# Altium schematic sheet Top Level.SchDoc
size 431 x 279 mm; CompanyName: Penn Electric Racing; Organization: Penn Electric Racing; Address1: 220 S. 33rd St; Address2: Towne Bldg, B11; Address3: Philadelpia, PA 19104; Address4: USA; SheetNumber: 1; SheetTotal: 12
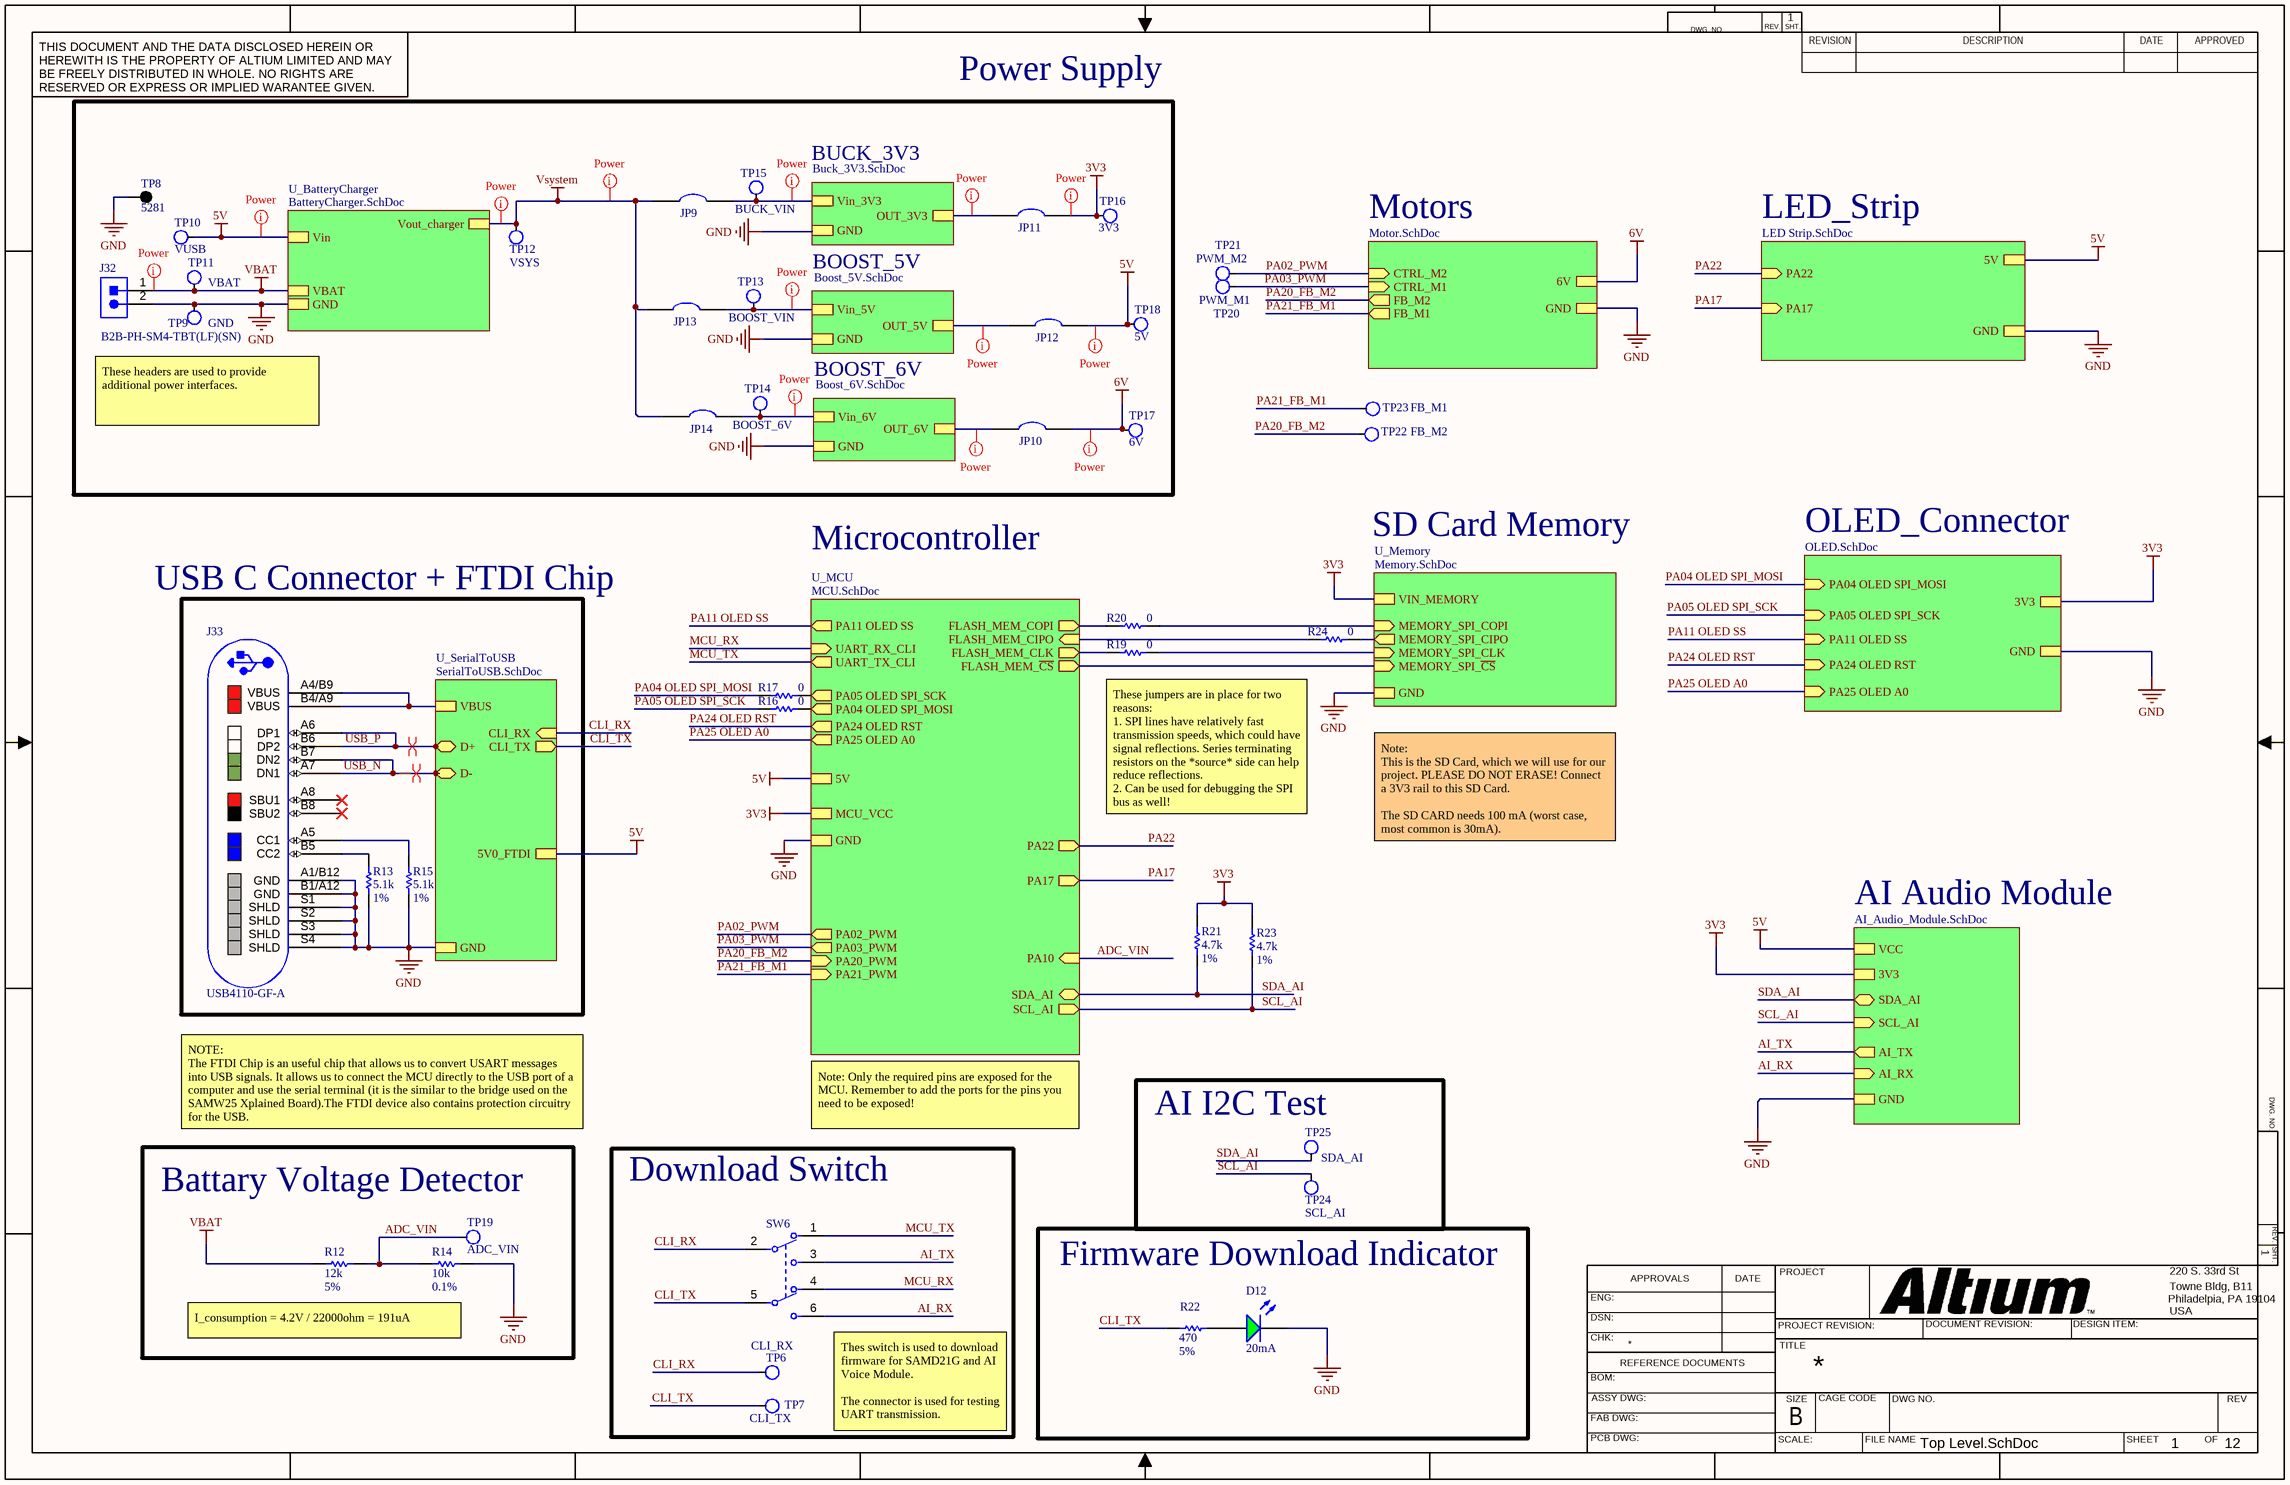
[diagram p0: Top Level.SchDoc]

## Parts
D12  Current: 20mA  [LED_0805]  (hidden comment: LSM0805452V)
J32  B2B-PH-SM4-TBT(LF)(SN)  [FP-B2B-PH-SM4-TBT_LF_SN-MFG]
J33  USB4110-GF-A  [FP-USB4110-GF-A-MFG]
JP9  0603 link  [0603_JP_RES]  (value not drawn)
JP10  0603 link  [0603_JP_RES]  (value not drawn)
JP11  0603 link  [0603_JP_RES]  (value not drawn)
JP12  0603 link  [0603_JP_RES]  (value not drawn)
JP13  0603 link  [0603_JP_RES]  (value not drawn)
JP14  0603 link  [0603_JP_RES]  (value not drawn)
R12  value 12k  Tolerance: 5%  [0603_RES]  (hidden comment: RES 0603 12K 5%)
R13  value 5.1k  Tolerance: 1%  [0603_RES]  (hidden comment: RES 0603 5.1K 1%)
R14  value 10k  Tolerance: 0.1%  [0603_RES]  (hidden comment: RES 0603 10K 0.1%)
R15  value 5.1k  Tolerance: 1%  [0603_RES]  (hidden comment: RES 0603 5.1K 1%)
R16  value 0  [0603_RES]  (hidden comment: RES 0603 0 5%)
R17  value 0  [0603_RES]  (hidden comment: RES 0603 0 5%)
R19  value 0  [0603_RES]  (hidden comment: RES 0603 0 5%)
R20  value 0  [0603_RES]  (hidden comment: RES 0603 0 5%)
R21  value 4.7k  Tolerance: 1%  [0603_RES]  (hidden comment: RES 0603 4.7K 1%)
R22  value 470  Tolerance: 5%  [0805_RES]  (hidden comment: RES 0805 470 5%)
R23  value 4.7k  Tolerance: 1%  [0603_RES]  (hidden comment: RES 0603 4.7K 1%)
R24  value 0  [0603_RES]  (hidden comment: RES 0603 0 5%)
SW6  JS202011JCQN  [FP-JS202011JCQN-MFG]  (value not drawn)
TP6  NetName: CLI_RX  [Keystone 5000 Series]  (hidden comment: Testpad)  (no BOM)
TP7  NetName: CLI_TX  [Keystone 5000 Series]  (hidden comment: Testpad)  (no BOM)
TP8  5281  [KSTN-5011_V]
TP9  NetName: GND  [Testpad-HeaderPin]  (hidden comment: Testpad)  (no BOM)
TP10  NetName: VUSB  [Keystone 5000 Series]  (hidden comment: Testpad)  (no BOM)
TP11  NetName: VBAT  [Keystone 5000 Series]  (hidden comment: Testpad)  (no BOM)
TP12  NetName: VSYS  [Keystone 5000 Series]  (hidden comment: Testpad)  (no BOM)
TP13  NetName: BOOST_VIN  [Keystone 5000 Series]  (hidden comment: Testpad)  (no BOM)
TP14  NetName: BOOST_6V  [Keystone 5000 Series]  (hidden comment: Testpad)  (no BOM)
TP15  NetName: BUCK_VIN  [Keystone 5000 Series]  (hidden comment: Testpad)  (no BOM)
TP16  NetName: 3V3  [Keystone 5000 Series]  (hidden comment: Testpad)  (no BOM)
TP17  NetName: 6V  [Keystone 5000 Series]  (hidden comment: Testpad)  (no BOM)
TP18  NetName: 5V  [Keystone 5000 Series]  (hidden comment: Testpad)  (no BOM)
TP19  NetName: ADC_VIN  [Keystone 5000 Series]  (hidden comment: Testpad)  (no BOM)
TP20  NetName: PWM_M1  [Keystone 5000 Series]  (hidden comment: Testpad)  (no BOM)
TP21  NetName: PWM_M2  [Keystone 5000 Series]  (hidden comment: Testpad)  (no BOM)
TP22  NetName: FB_M2  [Keystone 5000 Series]  (hidden comment: Testpad)  (no BOM)
TP23  NetName: FB_M1  [Keystone 5000 Series]  (hidden comment: Testpad)  (no BOM)
TP24  NetName: SCL_AI  [Keystone 5000 Series]  (hidden comment: Testpad)  (no BOM)
TP25  NetName: SDA_AI  [Keystone 5000 Series]  (hidden comment: Testpad)  (no BOM)

## Blocks framed on the sheet
Power Supply: J32 JP9-JP14 TP8-TP18
AI I2C Test: TP24 TP25
Battary Voltage Detector: R12 R14 TP19
Download Switch: SW6 TP6 TP7
Firmware Download Indicator: D12 R22

## Sub-sheets
AI Audio Module = AI_Audio_Module.SchDoc: SDA_AI (bidir), 3V3, GND, SCL_AI (in), AI_TX (out), AI_RX (in), VCC
BOOST_5V = Boost_5V.SchDoc: Vin_5V, OUT_5V, GND
BOOST_6V = Boost_6V.SchDoc: Vin_6V, OUT_6V, GND
BUCK_3V3 = Buck_3V3.SchDoc: Vin_3V3, OUT_3V3, GND
LED_Strip = LED Strip.SchDoc: PA22 (in), 5V, GND, PA17 (in)
Motors = Motor.SchDoc: 6V, GND, CTRL_M2 (in), CTRL_M1 (in), FB_M2 (out), FB_M1 (out)
OLED_Connector = OLED.SchDoc: PA04 OLED SPI_MOSI (in), PA05 OLED SPI_SCK (in), 3V3, PA11 OLED SS (in), GND, PA24 OLED RST (in), PA25 OLED A0 (in)
U_BatteryCharger = BatteryCharger.SchDoc: Vin, GND, VBAT, Vout_charger
U_MCU = MCU.SchDoc: MCU_VCC, GND, FLASH_MEM_~{CS} (out), FLASH_MEM_CLK (out), FLASH_MEM_CIPO (in), FLASH_MEM_COPI (out), PA02_PWM (out), PA03_PWM (out), PA20_PWM (in), PA21_PWM (in), PA22 (out), PA17 (out), PA10 (in), SDA_AI (bidir), SCL_AI (out), UART_TX_CLI (out), UART_RX_CLI (in), PA11 OLED SS (out), PA04 OLED SPI_MOSI (out), PA05 OLED SPI_SCK (out), PA25 OLED A0 (out), PA24 OLED RST (out), 5V
U_Memory = Memory.SchDoc: MEMORY_SPI_COPI (in), MEMORY_SPI_CIPO (out), MEMORY_SPI_CLK (in), MEMORY_SPI_~{CS} (in), VIN_MEMORY, GND
U_SerialToUSB = SerialToUSB.SchDoc: CLI_RX (in), CLI_TX (out), 5V0_FTDI, D- (bidir), D+ (bidir), GND, VBUS

## Nets
3V3: JP11.2 R21.2 R23.2 TP16.1 ; sheet U_MCU/MCU_VCC, sheet U_Memory/VIN_MEMORY, sheet OLED_Connector/3V3, sheet AI Audio Module/3V3
5V: JP12.2 TP10.1 TP18.1 ; sheet U_BatteryCharger/Vin, sheet U_SerialToUSB/5V0_FTDI, sheet U_MCU/5V, sheet LED_Strip/5V, sheet AI Audio Module/VCC
6V: JP10.2 TP17.1 ; sheet Motors/6V
GND: D12.K J32.2 J33.A1/B12(GND) J33.B1/A12(GND) J33.S1(SHLD) J33.S2(SHLD) J33.S3(SHLD) J33.S4(SHLD) R13.1 R14.2 R15.1 TP8.1 TP9.1 ; sheet U_BatteryCharger/GND, sheet U_SerialToUSB/GND, sheet U_MCU/GND, sheet U_Memory/GND, sheet Motors/GND, sheet LED_Strip/GND, sheet OLED_Connector/GND, sheet AI Audio Module/GND, sheet BUCK_3V3/GND, sheet BOOST_5V/GND, sheet BOOST_6V/GND
VBAT: J32.1 R12.1 TP11.1 ; sheet U_BatteryCharger/VBAT
Vsystem: JP9.1 JP13.1 JP14.1 TP12.1 ; sheet U_BatteryCharger/Vout_charger
ADC_VIN: R12.2 R14.1 TP19.1 ; sheet U_MCU/PA10
AI_RX: SW6.6 ; sheet AI Audio Module/AI_RX
AI_TX: SW6.3 ; sheet AI Audio Module/AI_TX
CLI_RX: SW6.2 TP6.1 ; sheet U_SerialToUSB/CLI_RX
CLI_TX: R22.1 SW6.5 TP7.1 ; sheet U_SerialToUSB/CLI_TX
MCU_RX: SW6.4 ; sheet U_MCU/UART_RX_CLI
MCU_TX: SW6.1 ; sheet U_MCU/UART_TX_CLI
PA02_PWM: TP21.1 ; sheet U_MCU/PA02_PWM, sheet Motors/CTRL_M2
PA03_PWM: TP20.1 ; sheet U_MCU/PA03_PWM, sheet Motors/CTRL_M1
PA04 OLED SPI_MOSI: R17.1 ; sheet OLED_Connector/PA04 OLED SPI_MOSI
PA05 OLED SPI_SCK: R16.1 ; sheet OLED_Connector/PA05 OLED SPI_SCK
PA11 OLED SS: sheet U_MCU/PA11 OLED SS, sheet OLED_Connector/PA11 OLED SS
PA17: sheet U_MCU/PA17, sheet LED_Strip/PA17
PA20_FB_M2: TP22.1 ; sheet U_MCU/PA20_PWM, sheet Motors/FB_M2
PA21_FB_M1: TP23.1 ; sheet U_MCU/PA21_PWM, sheet Motors/FB_M1
PA22: sheet U_MCU/PA22, sheet LED_Strip/PA22
PA24 OLED RST: sheet U_MCU/PA24 OLED RST, sheet OLED_Connector/PA24 OLED RST
PA25 OLED A0: sheet U_MCU/PA25 OLED A0, sheet OLED_Connector/PA25 OLED A0
SCL_AI: R23.1 TP24.1 ; sheet U_MCU/SCL_AI, sheet AI Audio Module/SCL_AI
SDA_AI: R21.1 TP25.1 ; sheet U_MCU/SDA_AI, sheet AI Audio Module/SDA_AI
USB_N: J33.A7(DN1) J33.B7(DN2) ; sheet U_SerialToUSB/D-
USB_P: J33.A6(DP1) J33.B6(DP2) ; sheet U_SerialToUSB/D+
NetD12_A: D12.A R22.2
NetJ33_A4/B9: J33.A4/B9(VBUS) J33.B4/A9(VBUS) ; sheet U_SerialToUSB/VBUS
NetJ33_A5: J33.A5(CC1) R15.2
NetJ33_B5: J33.B5(CC2) R13.2
NetJP9_2: JP9.2 TP15.1 ; sheet BUCK_3V3/Vin_3V3
NetJP10_1: JP10.1 ; sheet BOOST_6V/OUT_6V
NetJP11_1: JP11.1 ; sheet BUCK_3V3/OUT_3V3
NetJP12_1: JP12.1 ; sheet BOOST_5V/OUT_5V
NetJP13_2: JP13.2 TP13.1 ; sheet BOOST_5V/Vin_5V
NetJP14_2: JP14.2 TP14.1 ; sheet BOOST_6V/Vin_6V
NetR16_2: R16.2 ; sheet U_MCU/PA04 OLED SPI_MOSI
NetR17_2: R17.2 ; sheet U_MCU/PA05 OLED SPI_SCK
NetR19_1: R19.1 ; sheet U_MCU/FLASH_MEM_CLK
NetR19_2: R19.2 ; sheet U_Memory/MEMORY_SPI_CLK
NetR20_1: R20.1 ; sheet U_MCU/FLASH_MEM_COPI
NetR20_2: R20.2 ; sheet U_Memory/MEMORY_SPI_COPI
NetR24_1: R24.1 ; sheet U_MCU/FLASH_MEM_CIPO
NetR24_2: R24.2 ; sheet U_Memory/MEMORY_SPI_CIPO
(unnamed): sheet U_MCU/FLASH_MEM_~{CS}, sheet U_Memory/MEMORY_SPI_~{CS}

Not connected (* = marked no-connect by the designer): J33 A8(SBU1)* B8(SBU2)*

## Layout directives
net class Power: 5V, VBAT, Vsystem
differential pair; differential pair class USB; net class USB: USB_N, USB_P
mark named Power: 3V3, 5V, 6V, NetJP9_2, NetJP10_1, NetJP11_1, NetJP12_1, NetJP13_2, NetJP14_2, Vsystem

## Notes on the sheet
- These headers are used to provide additional power interfaces.
- Microcontroller
- SD Card Memory
- USB C Connector + FTDI Chip
- These jumpers are in place for two reasons:
  1. SPI lines have relatively fast transmission speeds, which could have signal reflections. Series terminating resistors on the *source* side can help reduce reflections.
  2. Can be used for debugging the SPI bus as well!
- Note:
  This is the SD Card, which we will use for our project. PLEASE DO NOT ERASE! Connect a 3V3 rail to this SD Card.
  The SD CARD needs 100 mA (worst case, most common is 30mA).
- NOTE:
  The FTDI Chip is an useful chip that allows us to convert USART messages into USB signals. It allows us to connect the MCU directly to the USB port of a computer and use the serial terminal (it is the similar to the bridge used on the SAMW25 Xplained Board).The FTDI device also contains protection circuitry for the USB.
- Note: Only the required pins are exposed for the MCU. Remember to add the ports for the pins you need to be exposed!
- I_consumption = 4.2V / 22000ohm = 191uA
- (near SW6) Thes switch is used to download firmware for SAMD21G and AI Voice Module.
  The connector is used for testing UART transmission.
- DWG. NO.
- REV.
- SHT.
- THIS DOCUMENT AND THE DATA DISCLOSED HEREIN OR HEREWITH IS THE PROPERTY OF ALTIUM LIMITED AND MAY BE FREELY DISTRIBUTED IN WHOLE. NO RIGHTS ARE RESERVED OR EXPRESS OR IMPLIED WARANTEE GIVEN.
- REVISION
- DESCRIPTION
- DATE
- APPROVED
- ENG:
- APPROVALS
- PROJECT
- DSN:
- CHK:
- REFERENCE DOCUMENTS
- PROJECT REVISION:
- TITLE
- DOCUMENT REVISION:
- DESIGN ITEM:
- BOM:
- FAB DWG:
- PCB DWG:
- ASSY DWG:
- SCALE:
- SIZE
- B
- CAGE CODE
- FILE NAME
- DWG NO.
- SHEET
- OF
- REV

## Library data of the parts
D12 = CMP-00038-4: Single Color LED, Green, 0805; Forward Voltage: 2V; Wavelength - Peak: 571nm; Package (Case): 0805; Test Current: 20mA; RoHS Compliant: Yes; Wavelength - Dominant: 571nm; Color: Green
J32 = CMP-00418-1: Connector Header, PH Series, 2 Position, 2.00mm, 100V, Surface Mount, Solder, Pick and Place, Natural.
J33 = CMP-00451-3: USB Connector, 16 Contact(s), Male, Right Angle, Surface Mount Terminal, Locking, Receptacle USB-C (USB TYPE-C) USB 2.0 Receptacle Connector 24 (16+8 Dummy) Position Surface Mount, Right Angle
JP9-JP14 = CMP-00422-5: 0O link, SMD, 0603, Solder Bridge Option; Manufacturer P/N: Various; Manufacturer: Generic; Description in Visual: 0O link, Solder Bridge/SMD, Open; Value: 0.025; Source: Shunts and Jumpers.SchLib; Pin Count: 2; Design Item ID: 0603 link; Component Type: Net Tie; P/N: 0603 link
R12 = CMP-005-002260-2: Resistor Surface Mount, 12K Ohms, 0603 Footprint, 5% Tolerance 0.1W; Manufacturer: Various; PCB Package: 0603; Description in Visual: Res SMT 12K 0603  5%  0.1W; Power Rating: 0.1W; Manufacturer P/N: RES 0603 12K 5%; Mount: SMT
R13 R15 = CMP-005-003296-4: Resistor Surface Mount, 5.1K Ohms, 0603 Footprint, 1% Tolerance 0.1W; Manufacturer: Various; PCB Package: 0603; Description in Visual: Res SMT 5.1K 0603  1%  0.1W; Manufacturer P/N: RES 0603 5.1K 1%; Mount: SMT; Power Rating: 0.1W
R14 = CMP-005-002155-2: Resistor Surface Mount, 10K Ohms, 0603 Footprint, 0.1% Tolerance 0.1W; Manufacturer: Various; PCB Package: 0603; Description in Visual: Res SMT 10K 0603  0.1%  0.1W; Manufacturer P/N: RES 0603 10K 0.1%; Power Rating: 0.1W; Mount: SMT
R16 R17 R19 R20 R24 = CMP-005-001964-4: Resistor Surface Mount, 0 Ohms, 0603 Footprint, 5% Tolerance 0.1W; Manufacturer P/N: RES 0603 0R 5%; Manufacturer: Various; Description in Visual: Res SMT 0 0603  5%  0.1W; PCB Package: 0603; Power Rating: 0.1W; Mount: SMT; Tolerance: 5%; JLCPCB Part #: C21189
R21 R23 = CMP-005-003137-2: Resistor Surface Mount, 4.7K Ohms, 0603 Footprint, 1% Tolerance 0.1W; Manufacturer: Various; Description in Visual: Res SMT 4.7K 0603  1%  0.1W; PCB Package: 0603; Power Rating: 0.1W; Mount: SMT; Manufacturer P/N: RES 0603 4.7K 1%
R22 = CMP-005-005144-2: Resistor Surface Mount, 470 Ohms, 0805 Footprint, 5% Tolerance 0.125W; Manufacturer P/N: RES 0805 470R 5%; Manufacturer: Various; PCB Package: 0805; Description in Visual: Res SMT 470 0805  5%  0.125W; Mount: SMT; Power Rating: 0.125W
SW6 = CMP-00536-1: Slide Switch, 2 Positions, DPDT, Latched, 0.3A, 6VDC, Solder Terminal, Surface Mount-straight; Switch Function: ON-ON; Type: Slide; Circuit: DPDT
TP6 TP7 TP9-TP25 = CMP-00049-8: Test Pad/Point (Testpoint, Testpad), for probing
TP8 = CMP-024-000010-2: Circuit Board Hardware - PCB TEST POINT BLACK MULTIPURPOSE 5011 5281